# EasyEDA Pro project Lumino Uno PCB.epro

# Schematic Schematic1
Board Name: Board1; Create Date: 2026-05-08; Page Name: P1; Project Name: PCBmcu; Schematic Name: Schematic1; Update Date: 2026-05-17; Company: EasyEDA.com; Page Size: A4; Version: V1.0
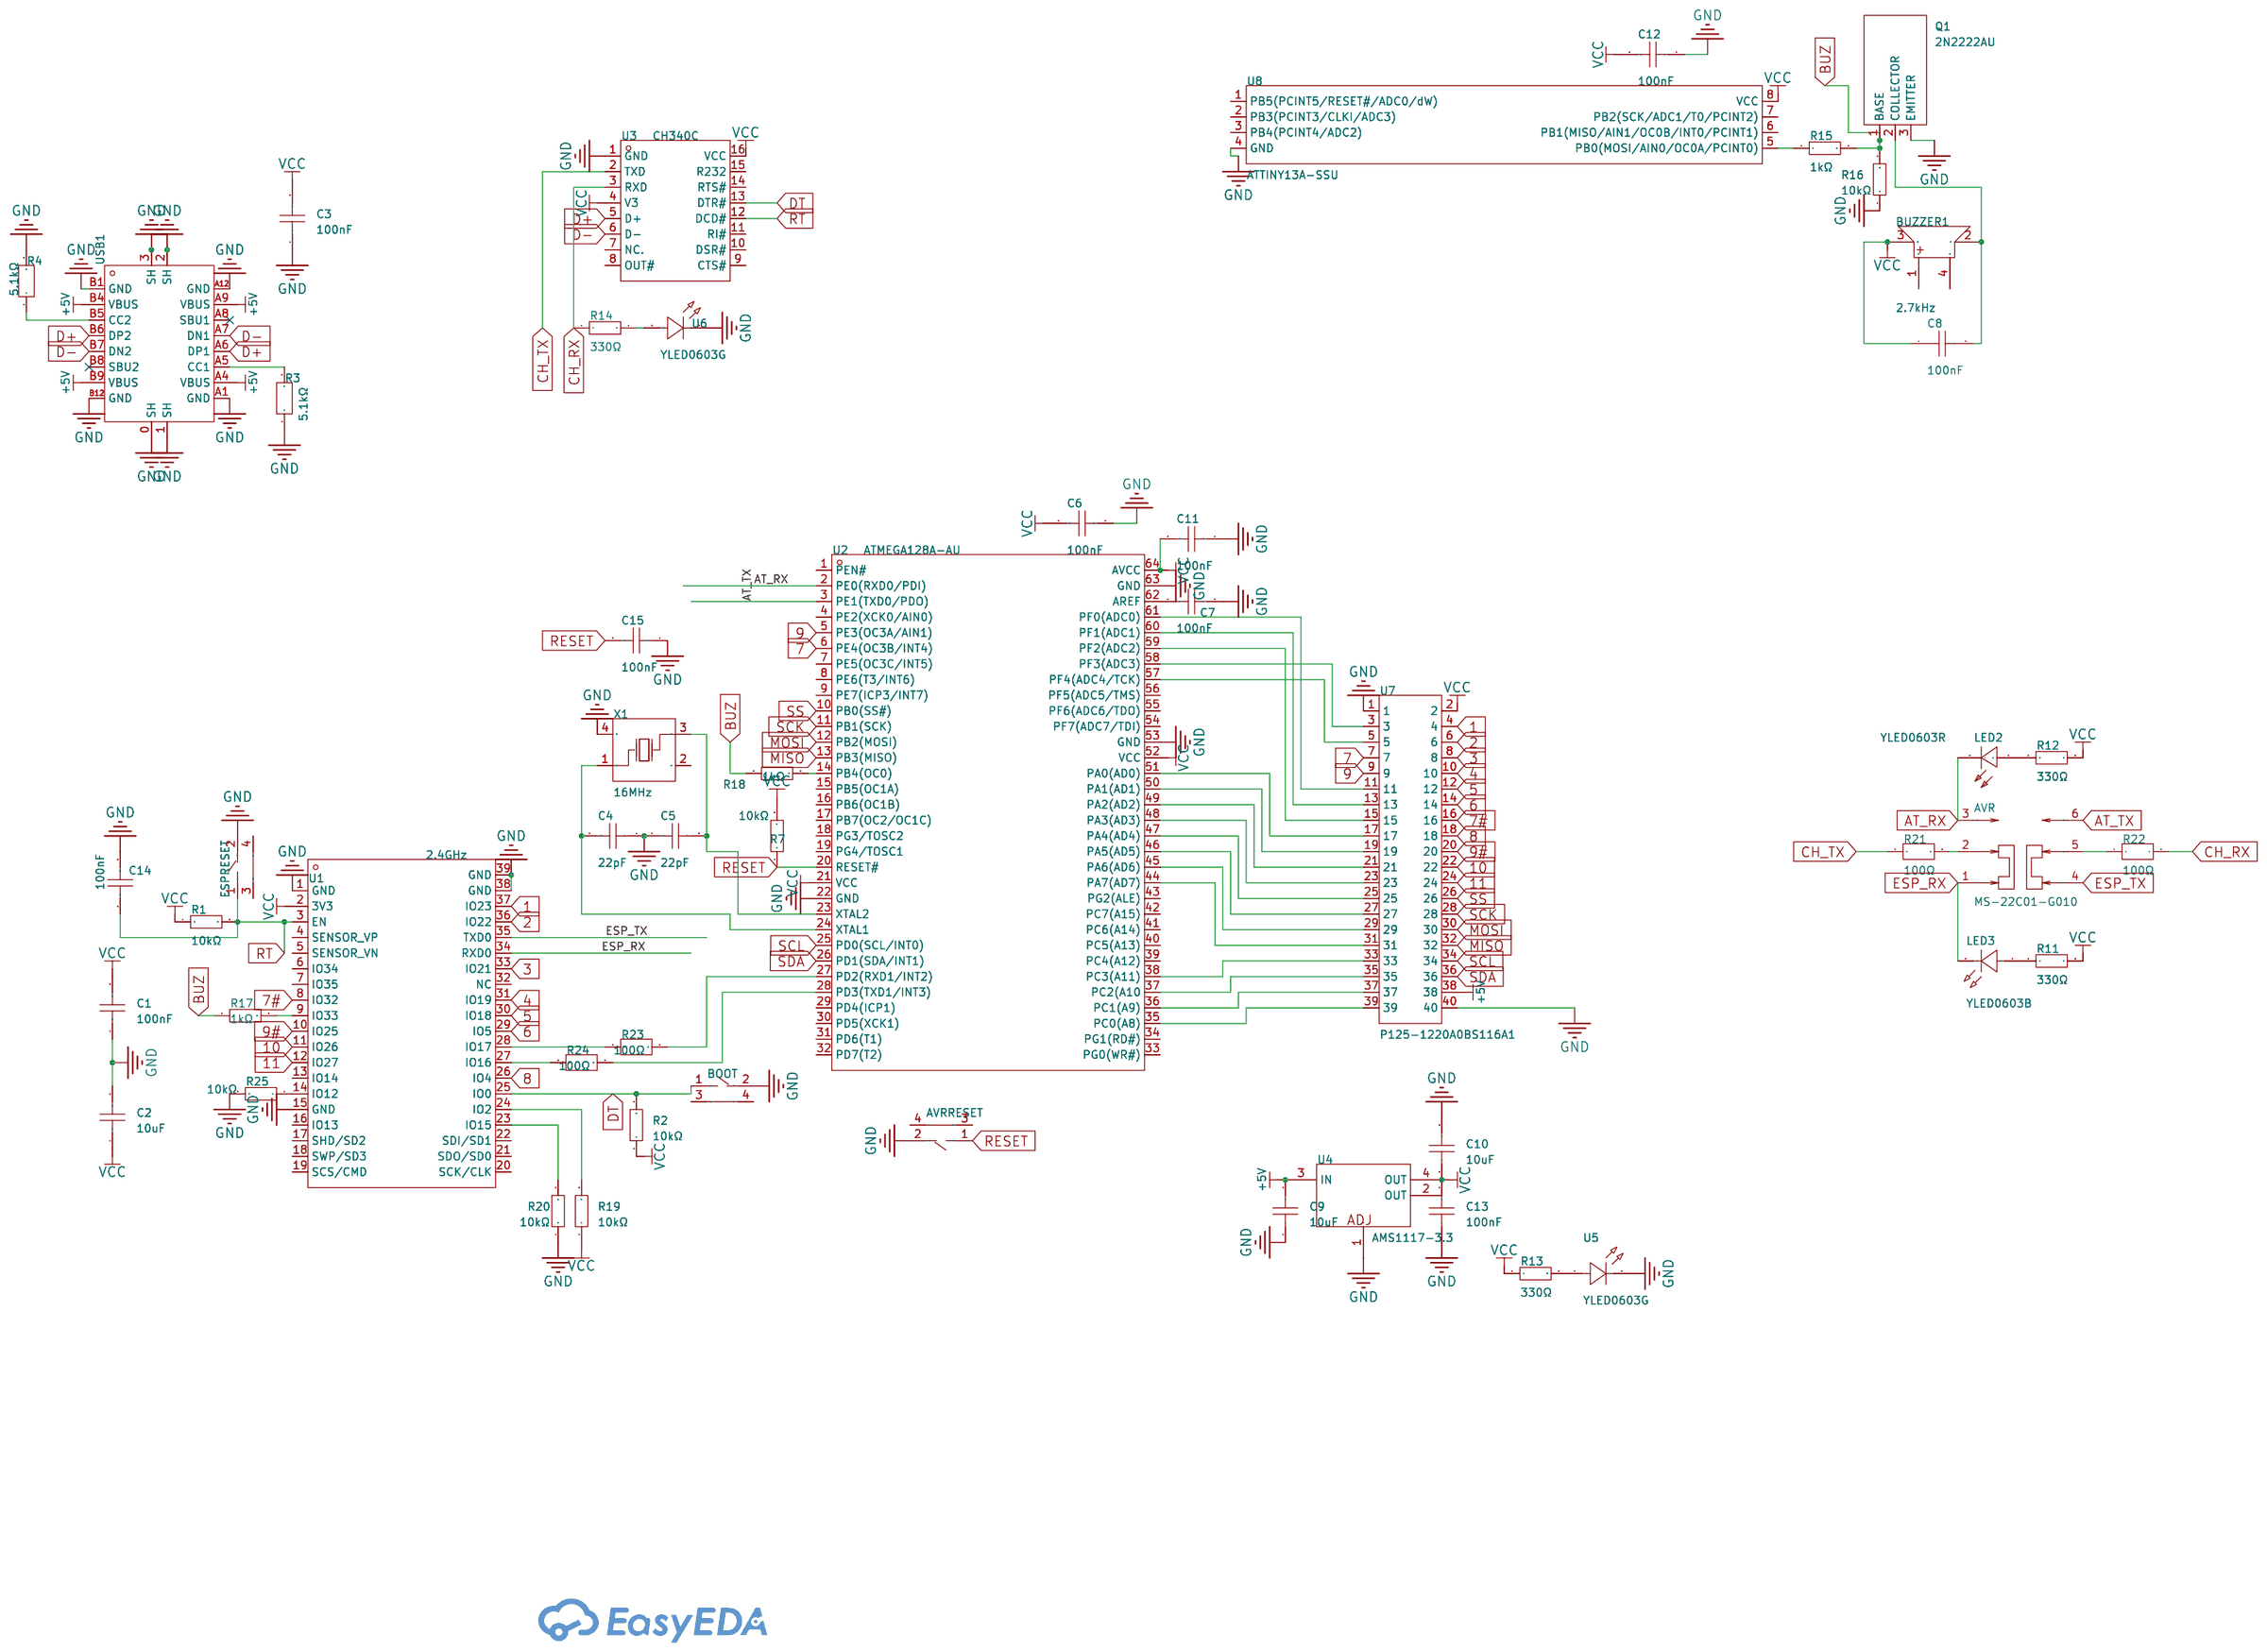
[diagram p0: schematic sheet]

## Parts
AVR  MS-22C01-G010  [SW-SMD_6P-L7.2-W3.5-P2.50-LS6.0-TL]
AVRRESET  TC-S3601-3.5-260G-F0.6  [SW-SMD_TC-S3601-3.5-260G-F0.6]
BOOT  TC-S3601-3.5-260G-F0.6  [SW-SMD_TC-S3601-3.5-260G-F0.6]
BUZZER1  2.7kHz  [BUZ-SMD_4P-L8.5-W8.5-BR-1]
C1  100nF  [C0603]
C2  10uF  [C0603]
C3  100nF  [C0603]
C4  22pF  [C0805]
C5  22pF  [C0805]
C6  100nF  [C0603]
C7  100nF  [C0603]
C8  100nF  [C0603]
C9  10uF  [C0603]
C10  10uF  [C0603]
C11  100nF  [C0603]
C12  100nF  [C0603]
C13  100nF  [C0603]
C14  100nF  [C0603]
C15  100nF  [C0603]
ESPRESET  TC-S3601-3.5-260G-F0.6  [SW-SMD_TC-S3601-3.5-260G-F0.6]
LED2  YLED0603R  [LED0603-FD]
LED3  YLED0603B  [LED0603-FD]
Q1  2N2222AU  [SOT-89-3_L4.5-W2.4-P1.50-LS4.0-BR]
R1  10kΩ  [R0603_NEW]
R2  10kΩ  [R0603_NEW]
R3  5.1kΩ  [R0603_NEW]
R4  5.1kΩ  [R0603_NEW]
R7  10kΩ  [R0603_NEW]
R11  330Ω  [R0603_NEW]
R12  330Ω  [R0603_NEW]
R13  330Ω  [R0603_NEW]
R14  330Ω  [R0603_NEW]
R15  1kΩ  [R0603_NEW]
R16  10kΩ  [R0603_NEW]
R17  1kΩ  [R0603_NEW]
R18  1kΩ  [R0603_NEW]
R19  10kΩ  [R0603_NEW]
R20  10kΩ  [R0603_NEW]
R21  100Ω  [R0603_NEW]
R22  100Ω  [R0603_NEW]
R23  100Ω  [R0603_NEW]
R24  100Ω  [R0603_NEW]
R25  10kΩ  [R0603_NEW]
U1  2.4GHz  [WIFIM-SMD_ESP32-WROOM-32-N4]
U2  ATMEGA128A-AU  [LQFP-64_L14.0-W14.0-P0.80-LS16.0-BL]
U3  CH340C  [SOP-16_L10.0-W3.9-P1.27-LS6.0-BL]
U4  AMS1117-3.3  [SOT-223_L6.5-W3.5-P2.30-LS7.0-BR]
U5  YLED0603G  [LED0603-FD]
U6  YLED0603G  [LED0603-FD]
U7  P125-1220A0BS116A1  [HDR-TH_40P-P2.54-V-M-R2-C20-S2.54_10-97-7406]
U8  ATTINY13A-SSU  [SOIC-8_L4.9-W3.9-P1.27-LS6.0-BL]
USB1  USB-TYPE-C-018  [USB-C_SMD-TYPE-C-31-M-12]
X1  16MHz  [OSC-SMD_4P-L7.0-W5.0-BL]

## Library data of the parts
AVR = MS-22C01-G010: Circuit:DPDT Actuator Style:Rectangular Columnar Termination Style:Gull Wing Length:7mm Width:3.5mm Switch Height:2.5mm Mounting Type:Surface Mount,Vertical Actuator Color:Black Current Rating:50mA Voltage Rating:12V Life:10,000 Cycles Operating Temperatu; LCSC Part Name: 微型拨动开关 G1.0mm; Supplier Part: C2837066; Manufacturer: G-Switch(品赞); Supplier Footprint: SMD,7x3.5mm; JLCPCB Part Class: Extended Part; Datasheet: https://item.szlcsc.com/datasheet/MS-22C01-G010/3006434.html; Supplier: LCSC; Circuit: DPDT; Actuator Style: Rectangular Columnar; Termination Style: Gull Wing; Length: 7mm; Width: 3.5mm; Switch Height: 2.5mm; Mounting Type: Surface Mount,Vertical; Actuator Color: Black; Current Rating: 50mA; Voltage Rating: 12V; Life: 10,000 Cycles; Operating Temperature: -40℃~+85℃
AVRRESET BOOT ESPRESET = TC-S3601-3.5-260G-F0.6: Circuit:SPST Actuator Style:Rectangular Button Operating Force:2.6N Mounting Type:Surface Mount, Right Angle Length:3.5mm Width:7mm with Bracket:With Bracket Contact Current:50mA Voltage Rating:12V With Lamp:No Termination Style:SMD(SMT) Tab Life:30,000 c; LCSC Part Name: 3.5mm 7mm 12V 50mA; Supplier Part: C49101620; Manufacturer: HCTL(华灿天禄); Supplier Footprint: SMD; JLCPCB Part Class: Extended Part; Datasheet: https://item.szlcsc.com/datasheet/TC-S3601-3.5-260G-F0.6/51479429.html; Supplier: LCSC; Circuit: SPST; Actuator Style: Rectangular Button; Operating Force: 2.6N; Mounting Type: Surface Mount, Right Angle; Length: 3.5mm; Width: 7mm; with Bracket: With Bracket; Contact Current: 50mA; Voltage Rating: 12V; With Lamp: No; Termination Style: SMD(SMT) Tab; Life: 30,000 cycles
BUZZER1 = SMD-8503-3627-16Ω: Driver Circuitry:Passive (Externally Driven) Technology:Electromagnetic Voltage - Supply:3.6V Voltage - Supply:3.6V Frequency:2.7kHz Sound Pressure Level(SPL):80dB Length:8.5mm Width:8.5mm Height:3mm; LCSC Part Name: 贴片无源蜂鸣器; Supplier Part: C2685545; Manufacturer: S&S(海旭); Supplier Footprint: SMD,8.5x8.5mm; JLCPCB Part Class: Extended Part; Datasheet: https://item.szlcsc.com/datasheet/SMD-8503-3627-16%25CE%25A9/2785331.html; Supplier: LCSC; Driver Circuitry: Passive (Externally Driven); Technology: Electromagnetic; Voltage - Supply: 3.6V; Sound Pressure Level(SPL): 80dB; Length: 8.5mm; Width: 8.5mm; Height: 3mm
C1 C3 C6-C8 C11-C15 = CC0603KRX7R9BB104: Capacitance:100nF Tolerance:±10% Tolerance:±10% Voltage Rating:50V Temperature Coefficient:X7R; LCSC Part Name: 100nF ±10% 50V; Supplier Part: C14663; Manufacturer: YAGEO(国巨); Supplier Footprint: 0603; JLCPCB Part Class: Basic Part; Datasheet: https://item.szlcsc.com/datasheet/CC0603KRX7R9BB104/15331.html; Supplier: LCSC; Tolerance: ±10%; Voltage Rating: 50V; Temperature Coefficient: X7R
C2 C9 C10 = CL10A106KP8NNNC: Capacitance:10uF Tolerance:±10% Tolerance:±10% Voltage Rating:10V Temperature Coefficient:X5R; LCSC Part Name: 10uF ±10% 10V; Supplier Part: C19702; Manufacturer: SAMSUNG(三星); Supplier Footprint: 0603; JLCPCB Part Class: Basic Part; Datasheet: https://item.szlcsc.com/datasheet/CL10A106KP8NNNC/20411.html; Supplier: LCSC; Tolerance: ±10%; Voltage Rating: 10V; Temperature Coefficient: X5R
C4 C5 = TCC0805COG220J500BT: Capacitance:22pF Tolerance:±5% Tolerance:±5% Voltage Rating:50V Temperature Coefficient:C0G; LCSC Part Name: 22pF ±5% 50V; Supplier Part: C376875; Manufacturer: CCTC(三环); Supplier Footprint: 0805; JLCPCB Part Class: Extended Part; Datasheet: https://item.szlcsc.com/datasheet/TCC0805COG220J500BT/349234.html; Supplier: LCSC; Tolerance: ±5%; Voltage Rating: 50V; Temperature Coefficient: C0G
LED2 = YLED0603R: Lamp Holder Type:-；- Illumination Color:Red Voltage - Forward(Vf):1.8V~2.4V Voltage - Forward(Vf):1.8V~2.4V Power(Watts):- Forward Current:25mA Wavelength - Dominant:620nm~625nm Wavelength - Dominant:620nm~625nm Peak Wavelength:- Diode Configuration:Discr; LCSC Part Name: 红色 独立二极管; Supplier Part: C19171390; Manufacturer: YONGYUTAI(永裕泰); Supplier Footprint: 0603; JLCPCB Part Class: Extended Part; Datasheet: https://item.szlcsc.com/datasheet/YLED0603R/20382441.html; Supplier: LCSC; Lamp Holder Type: -；-; Illumination Color: Red; Voltage - Forward(Vf): 1.8V~2.4V; Forward Current: 25mA; Wavelength - Dominant: 620nm~625nm; Diode Configuration: Discrete Diode; Luminous Intensity: 120mcd; Viewing Angle: 120°; Operating Temperature: -40℃~+85℃
LED3 = YLED0603B: Lamp Holder Type:- Illumination Color:Blue Voltage - Forward(Vf):2.6V~3.2V Voltage - Forward(Vf):2.6V~3.2V Power(Watts):- Forward Current:30mA Wavelength - Dominant:460nm~475nm Wavelength - Dominant:460nm~475nm Peak Wavelength:- Diode Configuration:Discre; LCSC Part Name: 蓝色 独立二极管; Supplier Part: C19171394; Manufacturer: YONGYUTAI(永裕泰); Supplier Footprint: 0603; JLCPCB Part Class: Extended Part; Datasheet: https://item.szlcsc.com/datasheet/YLED0603B/20382445.html; Supplier: LCSC; Illumination Color: Blue; Voltage - Forward(Vf): 2.6V~3.2V; Forward Current: 30mA; Wavelength - Dominant: 460nm~475nm; Diode Configuration: Discrete Diode; Luminous Intensity: 42mcd~86mcd; Viewing Angle: 120°; Operating Temperature: -40℃~+85℃
Q1 = 2N2222AU: type:NPN Current - Collector(Ic):600mA Collector - Emitter Voltage VCEO:40V Pd - Power Dissipation:500mW DC Current Gain:300@150mA,10V DC Current Gain:300@150mA,10V Transition frequency(fT):300MHz Current - Collector Cutoff:10nA Vce Saturation(VCE(sat)):1; LCSC Part Name: NPN 电流:600mA 电压:40V; Supplier Part: C21714170; Manufacturer: CBI(创基); Supplier Footprint: SOT-89; JLCPCB Part Class: Extended Part; Datasheet: https://item.szlcsc.com/datasheet/2N2222AU/23141081.html; Supplier: LCSC; type: NPN; Current - Collector(Ic): 600mA; Collector - Emitter Voltage VCEO: 40V; Pd - Power Dissipation: 500mW; DC Current Gain: 300@150mA,10V; Transition frequency(fT): 300MHz; Current - Collector Cutoff: 10nA; Vce Saturation(VCE(sat)): 1V@500mA,50mA; Operating Temperature: -55℃~+150℃; Emitter-Base Voltage(Vebo): 6V; Number: 1 NPN
R1 R2 R7 R16 R19 R20 R25 = RC0603FR-0710KL: Type:Thick Film Resistors Resistance: Tolerance:±1% Tolerance:±1% Power(Watts): Overload Voltage (Max): Temperature Coefficient:±100ppm/℃ Temperature Coefficient:±100ppm/℃ Operating Temperature Range:-55℃~+155℃ Operating Temperature Range:-55℃~+155℃; LCSC Part Name: 厚膜电阻 10kΩ ±1% 100mW; Supplier Part: C98220; Manufacturer: YAGEO(国巨); Supplier Footprint: 0603; JLCPCB Part Class: Extended Part; Datasheet: https://atta.szlcsc.com/upload/public/pdf/source/20180927/C295883_E8D83085EA81BD7DE0B2B681138C15EE.pdf; Supplier: LCSC; Type: Thick Film Resistors; Tolerance: ±1%; Temperature Coefficient: ±100ppm/℃; Operating Temperature Range: -55℃~+155℃
R3 R4 = FRC0603F5101TS: Type:Thick Film Resistor Resistance:5.1kΩ Tolerance:±1% Tolerance:±1% Power(Watts):100mW Voltage-Supply(Max):75V Temperature Coefficient:±100ppm/℃ Temperature Coefficient:±100ppm/℃ Operating Temperature:-55℃~+155℃ Operating Temperature:-55℃~+155℃; LCSC Part Name: 5.1kΩ ±1% 100mW 厚膜电阻; Supplier Part: C2907044; Manufacturer: FOJAN(富捷); Supplier Footprint: 0603; JLCPCB Part Class: Extended Part; Supplier: LCSC; Type: Thick Film Resistor; Tolerance: ±1%; Power(Watts): 100mW; Voltage-Supply(Max): 75V; Temperature Coefficient: ±100ppm/℃; Operating Temperature: -55℃~+155℃
R11-R14 = RC0603FR-07330RL: Type:Thick Film Resistors Resistance: Tolerance:±1% Tolerance:±1% Power(Watts): Overload Voltage (Max): Temperature Coefficient:±100ppm/℃ Temperature Coefficient:±100ppm/℃ Operating Temperature Range:-55℃~+155℃ Operating Temperature Range:-55℃~+155℃; LCSC Part Name: 厚膜电阻 330Ω ±1% 100mW; Supplier Part: C105881; Manufacturer: YAGEO(国巨); Supplier Footprint: 0603; JLCPCB Part Class: Extended Part; Datasheet: https://atta.szlcsc.com/upload/public/pdf/source/20180821/C275644_0D56F95EFF785E7D9A1FEF436B37DA78.pdf; Supplier: LCSC; Type: Thick Film Resistors; Tolerance: ±1%; Temperature Coefficient: ±100ppm/℃; Operating Temperature Range: -55℃~+155℃
R15 R17 R18 = RC0603FR-071KL: Type:Thick Film Resistor Resistance:1kΩ Tolerance:±1% Tolerance:±1% Power(Watts):100mW Voltage-Supply(Max):75V Temperature Coefficient:±100ppm/℃ Temperature Coefficient:±100ppm/℃ Operating Temperature:-55℃~+155℃ Operating Temperature:-55℃~+155℃; LCSC Part Name: 厚膜电阻 1kΩ ±1% 100mW; Supplier Part: C22548; Manufacturer: YAGEO(国巨); Supplier Footprint: 0603; JLCPCB Part Class: Extended Part; Datasheet: https://item.szlcsc.com/datasheet/RC0603FR-071KL/23274.html; Supplier: LCSC; Type: Thick Film Resistor; Tolerance: ±1%; Power(Watts): 100mW; Voltage-Supply(Max): 75V; Temperature Coefficient: ±100ppm/℃; Operating Temperature: -55℃~+155℃
R21-R24 = 0603 ±1% 100Ω: Type:Thick Film Resistor Resistance:100Ω Tolerance:±1% Tolerance:±1% Power(Watts):100mW Voltage-Supply(Max):75V Temperature Coefficient:±100ppm/℃ Temperature Coefficient:±100ppm/℃ Operating Temperature:-55℃~+155℃ Operating Temperature:-55℃~+155℃; LCSC Part Name: 厚膜电阻 100Ω ±1% 100mW; Supplier Part: C2889384; Manufacturer: VO(翔胜); Supplier Footprint: 0603; Datasheet: https://item.szlcsc.com/datasheet/0603%2520%25C2%25B11%2525%2520100%25CE%25A9/3112135.html; Supplier: LCSC; Type: Thick Film Resistor; Tolerance: ±1%; Power(Watts): 100mW; Voltage-Supply(Max): 75V; Temperature Coefficient: ±100ppm/℃; Operating Temperature: -55℃~+155℃
U1 = ESP32-WROOM-32-N4: Utilized IC / Part:ESP32-DOWDQ6 Wireless Standard:Bluetooth4.2 Interface Type:I2C；GPIO；UART；DAC；SPI；PWM；SDIO；ADC Frequency:2.4GHz Output Power:20dBm Output Power:20dBm Voltage - Supply:2.7V~3.6V Voltage - Supply:2.7V~3.6V Sensitivity:-98dBm Sensitivity:-9; LCSC Part Name: 不带固件 WiFi+蓝牙4.2+双核CPU模块; Supplier Part: C82899; Manufacturer: ESPRESSIF(乐鑫); Supplier Footprint: SMD,25.5x18mm; Datasheet: https://item.szlcsc.com/datasheet/ESP32-WROOM-32-N4/84060.html; Supplier: LCSC; Utilized IC / Part: ESP32-DOWDQ6; Wireless Standard: Bluetooth4.2; Interface Type: I2C；GPIO；UART；DAC；SPI；PWM；SDIO；ADC; Output Power: 20dBm; Voltage - Supply: 2.7V~3.6V; Sensitivity: -98dBm; Operating Temperature: -40℃~+85℃
U2 = ATMEGA128A-AU: CPU Core:AVR CPU Maximum Speed:16MHz Program Storage Size:128KB Program Memory Type:FLASH EEPROM:4KB Number of I/O:53 ADC (Bit):10bit Voltage - Supply:2.7V~5.5V Voltage - Supply:2.7V~5.5V Applications:-; LCSC Part Name: 8位AVR微控制器，带有128K字节系统内可编程闪存; Supplier Part: C6510; Manufacturer: MICROCHIP(美国微芯); Supplier Footprint: TQFP-64(14x14); JLCPCB Part Class: Extended Part; Datasheet: https://item.szlcsc.com/datasheet/ATMEGA128A-AU/6975.html; Supplier: LCSC; CPU Core: AVR; CPU Maximum Speed: 16MHz; Program Storage Size: 128KB; Program Memory Type: FLASH; EEPROM: 4KB; Number of I/O: 53; ADC (Bit): 10bit; Voltage - Supply: 2.7V~5.5V
U3 = CH340C: Applications Function:Transceiver USB Protocol:USB 2.0 Voltage - Supply:3.3V；5V Voltage - Supply:3.3V；5V Data Rate:2Mbps Operating Temperature:-20℃~+70℃ Operating Temperature:-20℃~+70℃ Current - Supply:7mA Supply Current (Iq):50uA; LCSC Part Name: USB转串口芯片; Supplier Part: C84681; Manufacturer: WCH(南京沁恒); Supplier Footprint: SOP-16; JLCPCB Part Class: Extended Part; Datasheet: https://item.szlcsc.com/datasheet/CH340C/85852.html; Supplier: LCSC; Applications Function: Transceiver; USB Protocol: USB 2.0; Voltage - Supply: 3.3V；5V; Data Rate: 2Mbps; Operating Temperature: -20℃~+70℃; Current - Supply: 7mA; Supply Current (Iq): 50uA
U4 = AMS1117-3.3_C22458961: Output Type:Fixed Voltage - Supply:20V Output Voltage:3.3V Output Voltage:3.3V Output Current:1A Power Supply Rejection Ratio (PSRR):50dB@(120Hz) Voltage Dropout:1.15V@(1A) standby current:5mA Features:Over Temperature Protection；Over Current Protection O; LCSC Part Name: 丝印AMS11173.31407 3.3V 1A 20V; Supplier Part: C22458961; Manufacturer: ALJ(龙晶微); Supplier Footprint: SOT-223; JLCPCB Part Class: Extended Part; Datasheet: https://item.szlcsc.com/datasheet/AMS1117-3.3/24132009.html; Supplier: LCSC; Output Type: Fixed; Voltage - Supply: 20V; Output Voltage: 3.3V; Output Current: 1A; Power Supply Rejection Ratio (PSRR): 50dB@(120Hz); Voltage Dropout: 1.15V@(1A); standby current: 5mA; Features: Over Temperature Protection；Over Current Protection; Operating Temperature: -40℃~+125℃@(Tj)
U5 U6 = YLED0603G: Lamp Holder Type:- Illumination Color:Emerald Green Voltage - Forward(Vf):2.6V~3.2V Voltage - Forward(Vf):2.6V~3.2V Power(Watts):- Forward Current:25mA Wavelength - Dominant:510nm~531nm Wavelength - Dominant:510nm~531nm Peak Wavelength:- Peak Wavelength:-; LCSC Part Name: 翠绿色 独立二极管; Supplier Part: C19273151; Manufacturer: YONGYUTAI(永裕泰); Supplier Footprint: 0603; JLCPCB Part Class: Extended Part; Datasheet: https://item.szlcsc.com/datasheet/YLED0603G/20555405.html; Supplier: LCSC; Illumination Color: Emerald Green; Voltage - Forward(Vf): 2.6V~3.2V; Forward Current: 25mA; Wavelength - Dominant: 510nm~531nm; Diode Configuration: Discrete Diode; Luminous Intensity: 358mcd; Viewing Angle: 120°; Operating Temperature: -40℃~+85℃
U7 = P125-1220A0BS116A1: Pin Structure:2x20P Pitch:2.54mm Row Spacing:2.54mm Circluar Pins/Square Pins:Policy Mounting Type:Straight Number of Rows:Double Row Number of Pins:40P Length of Mating Pin:6mm Insulation Height:2.5mm Length of End Connection Pin:3mm Contact Material:Bra; LCSC Part Name: 2x20P 间距:2.54mm 方针 直插; Supplier Part: C19190512; Manufacturer: Yxcon(宇熙精密); Supplier Footprint: 插件,P=2.54mm; JLCPCB Part Class: Extended Part; Datasheet: https://atta.szlcsc.com/upload/public/pdf/source/20231110/933F8D648B10E9101EFC894132A28518.pdf; Supplier: LCSC; Pin Structure: 2x20P; Pitch: 2.54mm; Row Spacing: 2.54mm; Circluar Pins/Square Pins: Policy; Mounting Type: Straight; Number of Rows: Double Row; Number of Pins: 40P; Length of Mating Pin: 6mm; Insulation Height: 2.5mm; Length of End Connection Pin: 3mm; Contact Material: Brass; Contact Plating: Gold; Operating Temperature: -40℃~+105℃; Color: Black
U8 = ATTINY13A-SSU: CPU Core:AVR CPU Maximum Speed:20MHz Program Storage Size:1KB Number of I/O:6 ADC (Bit):10bit Voltage - Supply:1.8V~5.5V Voltage - Supply:1.8V~5.5V Applications:-; Supplier Part: C14075; Manufacturer: MICROCHIP(美国微芯); Supplier Footprint: SOIC-8; JLCPCB Part Class: Extended Part; Datasheet: https://item.szlcsc.com/datasheet/ATTINY13A-SSU/14732.html; Supplier: LCSC; CPU Core: AVR; CPU Maximum Speed: 20MHz; Program Storage Size: 1KB; Number of I/O: 6; ADC (Bit): 10bit; Voltage - Supply: 1.8V~5.5V
USB1 = USB-TYPE-C-018: Connector Type:Type-C Protocol Standard:- Gender:Female Mounting Type:Surface Mount, Right Angle Number of Contacts:16P Number of Ports:1 Current Rating-Power:3A Voltage Rating:5V Connect-Disconnect Life:10,000 cycles Length:7.35mm Operating Temperature:-; LCSC Part Name: Type-C 母 卧贴; Supplier Part: C2927038; Manufacturer: DEALON(德艺隆); Supplier Footprint: SMD; JLCPCB Part Class: Extended Part; Datasheet: https://item.szlcsc.com/datasheet/USB-TYPE-C-018/3252507.html; Supplier: LCSC; Connector Type: Type-C; Gender: Female; Mounting Type: Surface Mount, Right Angle; Number of Contacts: 16P; Number of Ports: 1; Current Rating-Power: 3A; Voltage Rating: 5V; Connect-Disconnect Life: 10,000 cycles; Length: 7.35mm; Operating Temperature: -25℃~+85℃
X1 = OCETDLJANF-16MHZ: Frequency:16MHz Voltage - Supply:3.3V Voltage - Supply:3.3V Current - Supply:10mA Frequency Stability:±25ppm Frequency Stability:±25ppm Operating Temperature:-40℃~+85℃ Operating Temperature:-40℃~+85℃; LCSC Part Name: 16MHz 3.3V; Supplier Part: C295103; Manufacturer: TAITIEN(泰艺电子); Supplier Footprint: SMD7050-4P; JLCPCB Part Class: Extended Part; Datasheet: https://item.szlcsc.com/datasheet/OCETDLJANF-16MHZ/279933.html; Supplier: LCSC; Voltage - Supply: 3.3V; Current - Supply: 10mA; Frequency Stability: ±25ppm; Operating Temperature: -40℃~+85℃

## Nets
+5V: C9.2 U4.3(IN) U7.38 USB1.A4(VBUS) USB1.A9(VBUS) USB1.B4(VBUS) USB1.B9(VBUS)
GND: AVRRESET.2 BOOT.2 C1.1 C2.2 C3.1 C4.1 C5.1 C6.1 C7.1 C9.1 C10.2 C11.1 C12.1 C13.1 C14.2 C15.1 ESPRESET.2 Q1.3(EMITTER) R3.1 R4.2 R16.1 R20.1 R25.2 U1.1(GND) U1.15(GND) U1.38(GND) U1.39(GND) U2.22(GND) U2.53(GND) U2.63(GND) U3.1(GND) U4.1(ADJ) U5.2(-) U6.2(-) U7.1 U7.40 U8.4(GND) USB1.0(SH) USB1.1(SH) USB1.2(SH) USB1.3(SH) USB1.A1(GND) USB1.A12(GND) USB1.B1(GND) USB1.B12(GND) X1.4(vdd)
VCC: BUZZER1.3 C1.2 C2.1 C3.2 C6.2 C8.1 C10.1 C11.2 C12.2 C13.2 R1.1 R2.1 R7.2 R11.2 R12.2 R13.1 R19.1 U1.2(3V3) U2.21(VCC) U2.52(VCC) U2.64(AVCC) U3.4(V3) U3.16(VCC) U4.4(OUT) U7.2 U8.8(VCC)
1: U1.37(IO23) U7.4
2: U1.36(IO22) U7.6
3: U1.33(IO21) U7.8
4: U1.31(IO19) U7.10
5: U1.30(IO18) U7.12
6: U1.29(IO5) U7.14
7: U2.6(PE4(OC3B/INT4)) U7.7
7#: U1.8(IO32) U7.16
8: U1.26(IO4) U7.18
9: U2.5(PE3(OC3A/AIN1)) U7.9
9#: U1.10(IO25) U7.20
10: U1.11(IO26) U7.22
11: U1.12(IO27) U7.24
AT_RX: AVR.3 LED2.2(-) U2.2(PE0(RXD0/PDI))
AT_TX: AVR.6 U2.3(PE1(TXD0/PDO))
BUZ: Q1.1(BASE) R15.2 R16.2 R17.1 R18.1
CH_RX: R14.1 R22.2 U3.3(RXD)
CH_TX: R21.1 U3.2(TXD)
D+: U3.5(D+) USB1.A6(DP1) USB1.B6(DP2)
D-: U3.6(D-) USB1.A7(DN1) USB1.B7(DN2)
DT: BOOT.1 R2.2 U1.25(IO0) U3.13(DTR#)
ESP_RX: AVR.1 LED3.2(K) U1.34(RXD0)
ESP_TX: AVR.4 U1.35(TXD0)
MISO: U2.13(PB3(MISO)) U7.32
MOSI: U2.12(PB2(MOSI)) U7.30
RESET: AVRRESET.1 C15.2 R7.1 U2.20(RESET#)
RT: C14.1 ESPRESET.1 R1.2 U1.3(EN) U3.12(DCD#)
SCK: U2.11(PB1(SCK)) U7.28
SCL: U2.25(PD0(SCL/INT0)) U7.34
SDA: U2.26(PD1(SDA/INT1)) U7.36
SS: U2.10(PB0(SS#)) U7.26
$1N2843: R3.2 USB1.A5(CC1)
$1N2847: R4.1 USB1.B5(CC2)
$1N4033: R14.2 U6.1(+)
$1N4987: C5.2 U2.23(XTAL2) X1.3(out)
$1N5002: C4.2 U2.24(XTAL1) X1.1(tri)
$1N5344: C7.2 U2.62(AREF)
$1N8862: U2.35(PC0(A8)) U7.39
$1N8867: U2.36(PC1(A9)) U7.37
$1N8877: U2.37(PC2(A10) U7.35
$1N8884: U2.38(PC3(A11)) U7.33
$1N9216: U2.44(PA7(AD7)) U7.31
$1N9221: U2.45(PA6(AD6)) U7.29
$1N9253: U2.46(PA5(AD5)) U7.27
$1N9297: U2.47(PA4(AD4)) U7.25
$1N9314: U2.48(PA3(AD3)) U7.23
$1N9319: U2.49(PA2(AD2)) U7.21
$1N9331: U2.50(PA1(AD1)) U7.19
$1N9344: U2.59(PF2(ADC2)) U7.15
$1N9350: U2.60(PF1(ADC1)) U7.13
$1N9358: U2.61(PF0(ADC0)) U7.11
$1N9422: U2.51(PA0(AD0)) U7.17
$1N9481: U2.58(PF3(ADC3)) U7.3
$1N9486: U2.57(PF4(ADC4/TCK)) U7.5
$1N13451: LED2.1(+) R12.1
$1N13493: R13.2 U5.1(+)
$1N13579: LED3.1(A) R11.1
$1N15542: R15.1 U8.5(PB0(MOSI/AIN0/OC0A/PCINT0))
$1N15554: BUZZER1.2 C8.2 Q1.2(COLLECTOR)
$1N17580: R17.2 U1.9(IO33)
$1N17638: R18.2 U2.14(PB4(OC0))
$1N19795: R19.2 U1.24(IO2)
$1N19800: R20.2 U1.23(IO15)
$1N20128: AVR.2 R21.2
$1N20208: AVR.5 R22.1
$1N20285: R23.1 U1.28(IO17)
$1N20290: R23.2 U2.27(PD2(RXD1/INT2))
$1N20374: R25.1 U1.14(IO12)
Net-(R24-1): R24.1 U1.27(IO16)
Net-(R24-2): R24.2 U2.28(PD3(TXD1/INT3))

Not connected (* = marked no-connect by the designer): AVRRESET 3 4; BOOT 3 4; BUZZER1 1 4; ESPRESET 3 4; U1 4(SENSOR_VP) 5(SENSOR_VN) 6(IO34) 7(IO35) 13(IO14) 16(IO13) 17(SHD/SD2) 18(SWP/SD3) 19(SCS/CMD) 20(SCK/CLK) 21(SDO/SD0) 22(SDI/SD1) 32(NC); U2 1(PEN#) 4(PE2(XCK0/AIN0)) 7(PE5(OC3C/INT5)) 8(PE6(T3/INT6)) 9(PE7(ICP3/INT7)) 15(PB5(OC1A)) 16(PB6(OC1B)) 17(PB7(OC2/OC1C)) 18(PG3/TOSC2) 19(PG4/TOSC1) 29(PD4(ICP1)) 30(PD5(XCK1)) 31(PD6(T1)) 32(PD7(T2)) 33(PG0(WR#)) 34(PG1(RD#)) 39(PC4(A12)) 40(PC5(A13)) 41(PC6(A14)) 42(PC7(A15)) 43(PG2(ALE)) 54(PF7(ADC7/TDI)) 55(PF6(ADC6/TDO)) 56(PF5(ADC5/TMS)); U3 7(NC.) 8(OUT#) 9(CTS#) 10(DSR#) 11(RI#) 14(RTS#) 15(R232); U4 2(OUT); U8 1(PB5(PCINT5/RESET#/ADC0/dW)) 2(PB3(PCINT3/CLKI/ADC3)) 3(PB4(PCINT4/ADC2)) 6(PB1(MISO/AIN1/OC0B/INT0/PCINT1)) 7(PB2(SCK/ADC1/T0/PCINT2)); USB1 A8(SBU1)* B8(SBU2)*; X1 2(GND)

# Board PCB1
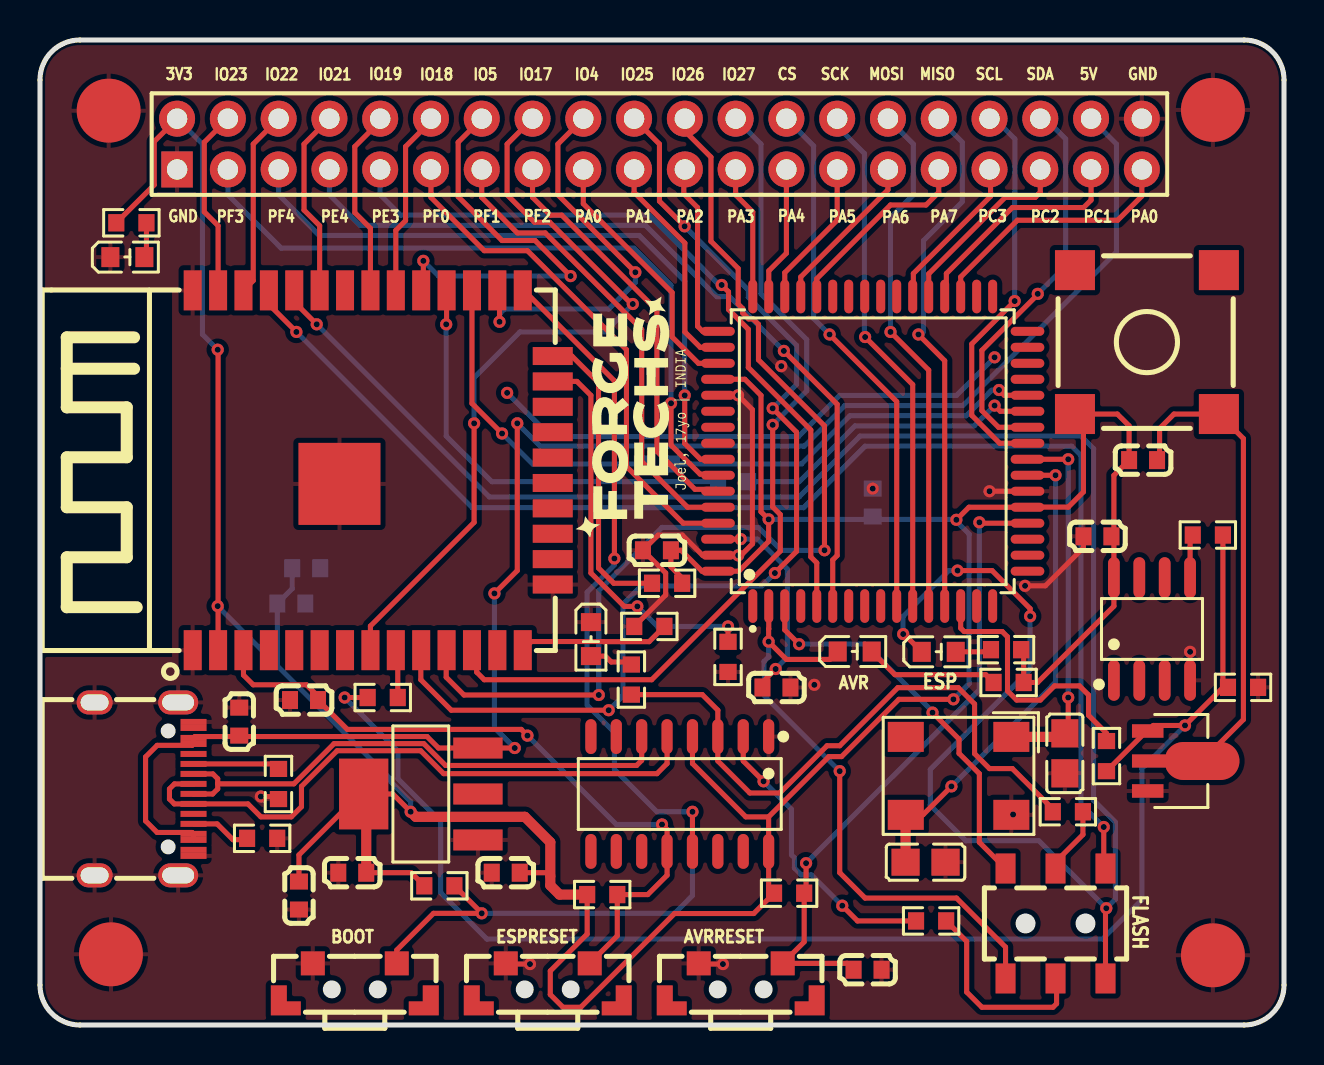
[diagram p1: board, top side]
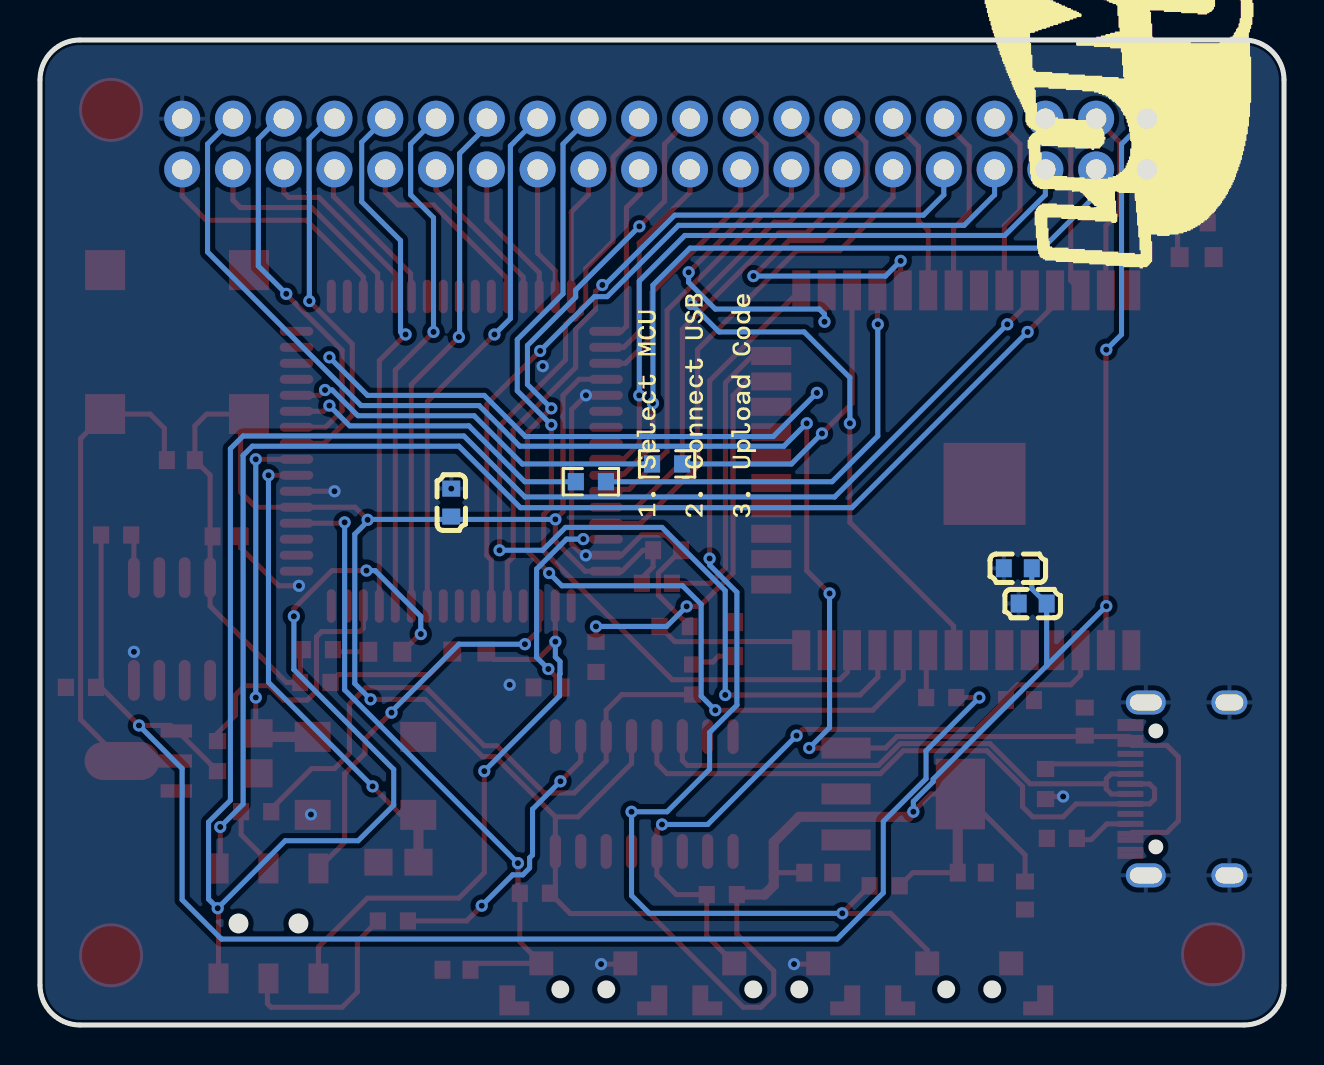
[diagram p2: board, bottom side, seen from below]

Outline 62.23 x 49.28 mm; copper layers: Top Layer, Bottom Layer. Coordinates in mm from the lower left corner of the outline.
Outline path: 0,47.28 0,2 arc(0.59,0.59) 2,0 60.23,0 arc(61.64,0.59) 62.23,2 62.23,47.28 arc(61.64,48.69) 60.23,49.28 2,49.28 arc(0.59,48.69) 0,47.28
Stack: Top Layer 0.035mm / Dielectric1 1.51mm FR4 er 4.5 / Bottom Layer 0.035mm

## Design rules (mm)
template: Custom Config
spacing copperThickness1oz (default): track to track 0.102, other pairs 0.1 to 0.3
spacing copperThickness2oz: track to track 0.203, other pairs 0.152 to 0.3
track width copperThickness1oz (default): min 0.127, default 0.254, max 2.54
track width copperThickness2oz: min 0.203, default 0.254, max 2.54
differential pair differentialPair (default): width min 0.127, default 0.254, max 2.54; gap min 0.152, default 0.152
via viaSize (default): diameter min 0.5, default 0.61, max 10; hole min 0.3, default 0.305, max 6.3

## Placement (name value [footprint] x y rotation side)
AVR  MS-22C01-G010  [SW-SMD_6P-L7.2-W3.5-P2.50-LS6.0-TL]  50.8 5.08 180 top
AVRRESET  TC-S3601-3.5-260G-F0.6  [SW-SMD_TC-S3601-3.5-260G-F0.6]  35.05 2.16 180 top
BOOT  TC-S3601-3.5-260G-F0.6  [SW-SMD_TC-S3601-3.5-260G-F0.6]  15.75 2.16 180 top
BUZZER1  2.7kHz  [BUZ-SMD_4P-L8.5-W8.5-BR-1]  55.37 34.16 90 top
C1  100nF  [C0603]  12.57 21.08 180 bottom
C2  10uF  [C0603]  13.32 22.85 0 bottom
C3  100nF  [C0603]  15.62 7.62 0 top
C4  22pF  [C0805]  51.27 13.59 90 top
C5  22pF  [C0805]  44.3 8.15 180 top
C6  100nF  [C0603]  41.66 26.13 270 bottom
C7  100nF  [C0603]  36.84 16.88 180 top
C8  100nF  [C0603]  55.18 28.26 0 top
C9  10uF  [C0603]  9.97 15.18 270 top
C10  10uF  [C0603]  23.3 7.62 180 top
C11  100nF  [C0603]  30.86 23.75 0 top
C12  100nF  [C0603]  52.9 24.45 0 top
C13  100nF  [C0603]  12.95 6.48 90 top
C14  100nF  [C0603]  13.21 16.26 180 top
C15  100nF  [C0603]  41.4 2.77 180 top
ESPRESET  TC-S3601-3.5-260G-F0.6  [SW-SMD_TC-S3601-3.5-260G-F0.6]  25.4 2.16 180 top
LED2  YLED0603R  [LED0603-FD]  40.75 18.68 180 top
LED3  YLED0603B  [LED0603-FD]  44.96 18.67 180 top
NOREF  -  [Pad_e2586]  58.67 3.49 180 top
NOREF#2  -  [Pad_e2583]  58.67 45.78 180 top
NOREF#3  -  [Pad_e2562]  3.55 3.54 0 top
NOREF#4  -  [Pad_e2559]  3.44 45.74 180 top
Q1  2N2222AU  [SOT-89-3_L4.5-W2.4-P1.50-LS4.0-BR]  56.77 13.21 180 top
R1  10kΩ  [R0603_NEW]  28.12 6.52 0 top
R2  10kΩ  [R0603_NEW]  19.98 6.96 0 top
R3  5.1kΩ  [R0603_NEW]  11.93 12.06 90 top
R4  5.1kΩ  [R0603_NEW]  11.11 9.34 0 top
R7  10kΩ  [R0603_NEW]  37.47 6.59 180 top
R11  330Ω  [R0603_NEW]  48.33 18.78 0 top
R12  330Ω  [R0603_NEW]  48.45 17.14 0 top
R13  330Ω  [R0603_NEW]  4.57 40.13 0 top
R14  330Ω  [R0603_NEW]  29.58 17.28 90 top
R15  1kΩ  [R0603_NEW]  58.42 24.51 0 top
R16  10kΩ  [R0603_NEW]  60.18 16.89 180 top
R17  1kΩ  [R0603_NEW]  17.14 16.38 0 top
R18  1kΩ  [R0603_NEW]  53.35 13.45 90 top
R19  10kΩ  [R0603_NEW]  31.37 22.1 180 top
R20  10kΩ  [R0603_NEW]  34.42 18.41 90 top
R21  100Ω  [R0603_NEW]  44.58 5.21 0 top
R22  100Ω  [R0603_NEW]  51.42 10.67 180 top
R23  100Ω  [R0603_NEW]  34.67 27.18 0 bottom
R24  100Ω  [R0603_NEW]  30.86 28.07 180 bottom
R25  10kΩ  [R0603_NEW]  30.48 19.94 180 top
U1  2.4GHz  [WIFIM-SMD_ESP32-WROOM-32-N4]  16.64 27.75 90 top
U2  ATMEGA128A-AU  [LQFP-64_L14.0-W14.0-P0.80-LS16.0-BL]  41.66 28.7 0 top
U3  CH340C  [SOP-16_L10.0-W3.9-P1.27-LS6.0-BL]  32 11.56 180 top
U4  AMS1117-3.3  [SOT-223_L6.5-W3.5-P2.30-LS7.0-BR]  19.05 11.56 0 top
U5  YLED0603G  [LED0603-FD]  4.37 38.41 180 top
U6  YLED0603G  [LED0603-FD]  27.56 19.3 90 top
U7  P125-1220A0BS116A1  [HDR-TH_40P-P2.54-V-M-R2-C20-S2.54_10-97-7406]  30.99 44.07 0 top
U8  ATTINY13A-SSU  [SOIC-8_L4.9-W3.9-P1.27-LS6.0-BL]  55.63 19.81 0 top
USB1  USB-TYPE-C-018  [USB-C_SMD-TYPE-C-31-M-12]  5.21 11.81 270 top
X1  16MHz  [OSC-SMD_4P-L7.0-W5.0-BL]  45.95 12.46 180 top

## Footprints (pads in the part's own frame, mm; a bottom-side part is the same pattern mirrored in y, then rotated)
BUZ-SMD_4P-L8.5-W8.5-BR-1
  rect 2x2 smd: 1(3.6,-3.6) 2(-3.6,-3.6) 3(-3.6,3.6) 4(3.599,3.599)
C0603
  rect 0.8x0.9 smd: 1(-0.7,0) 2(0.7,0)
C0805
  rect 1.41x1.35 smd: 1(-1,0) 2(1,0)
HDR-TH_40P-P2.54-V-M-R2-C20-S2.54_10-97-7406
  rect 1.575x1.8 hole 1.02: 1(-24.13,-1.27)
  round 1.8 hole 1.02: 2(-24.13,1.27) 3(-21.59,-1.27) 4(-21.59,1.27) 5(-19.05,-1.27) 6(-19.05,1.27) 7(-16.51,-1.27) 8(-16.51,1.27) 9(-13.97,-1.27) 10(-13.97,1.27) 11(-11.43,-1.27) 12(-11.43,1.27) 13(-8.89,-1.27) 14(-8.89,1.27) 15(-6.35,-1.27) 16(-6.35,1.27) 17(-3.81,-1.27) 18(-3.81,1.27) 19(-1.27,-1.27) 20(-1.27,1.27) 21(1.27,-1.27) 22(1.27,1.27) 23(3.81,-1.27) 24(3.81,1.27) 25(6.35,-1.27) 26(6.35,1.27) 27(8.89,-1.27) 28(8.89,1.27) 29(11.43,-1.27) 30(11.43,1.27) 31(13.97,-1.27) 32(13.97,1.27) 33(16.51,-1.27) 34(16.51,1.27) 35(19.05,-1.27) 36(19.05,1.27) 37(21.59,-1.27) 38(21.59,1.27) 39(24.13,-1.27) 40(24.13,1.27)
LED0603-FD
  rect 0.9x1 smd: 1(-0.85,0) 2(0.85,0)
LQFP-64_L14.0-W14.0-P0.80-LS16.0-BL
  oval 0.448x1.684 smd: 1(-6,-7.742) 2(-5.2,-7.742) 3(-4.4,-7.742) 4(-3.6,-7.742) 5(-2.8,-7.742) 6(-2,-7.742) 7(-1.2,-7.742) 8(-0.4,-7.742) 9(0.4,-7.742) 10(1.2,-7.742) 11(2,-7.742) 12(2.8,-7.742) 13(3.6,-7.742) 14(4.4,-7.742) 15(5.2,-7.742) 16(6,-7.742) 33(6,7.742) 34(5.2,7.742) 35(4.4,7.742) 36(3.6,7.742) 37(2.8,7.742) 38(2,7.742) 39(1.2,7.742) 40(0.4,7.742) 41(-0.4,7.742) 42(-1.2,7.742) 43(-2,7.742) 44(-2.8,7.742) 45(-3.6,7.742) 46(-4.4,7.742) 47(-5.2,7.742) 48(-6,7.742)
  oval 1.684x0.448 smd: 17(7.742,-6) 18(7.742,-5.2) 19(7.742,-4.4) 20(7.742,-3.6) 21(7.742,-2.8) 22(7.742,-2) 23(7.742,-1.2) 24(7.742,-0.4) 25(7.742,0.4) 26(7.742,1.2) 27(7.742,2) 28(7.742,2.8) 29(7.742,3.6) 30(7.742,4.4) 31(7.742,5.2) 32(7.742,6) 49(-7.742,6) 50(-7.742,5.2) 51(-7.742,4.4) 52(-7.742,3.6) 53(-7.742,2.8) 54(-7.742,2) 55(-7.742,1.2) 56(-7.742,0.4) 57(-7.742,-0.4) 58(-7.742,-1.2) 59(-7.742,-2) 60(-7.742,-2.8) 61(-7.742,-3.6) 62(-7.742,-4.4) 63(-7.742,-5.2) 64(-7.742,-6)
OSC-SMD_4P-L7.0-W5.0-BL
  rect 1.8x1.5 smd: 1(-2.64,-1.95) 2(2.64,-1.95) 3(2.64,1.95) 4(-2.64,1.95)
Pad_e2559
  round 3.2 smd: 1(0,0)
Pad_e2562
  round 3.2 smd: 1(0,0)
Pad_e2583
  round 3.2 smd: 1(0,0)
Pad_e2586
  round 3.2 smd: 1(0,0)
R0603_NEW
  rect 0.806x0.864 smd: 1(-0.753,0) 2(0.753,0)
SOIC-8_L4.9-W3.9-P1.27-LS6.0-BL
  oval 0.588x2.045 smd: 1(-1.905,-2.57) 2(-0.635,-2.57) 3(0.635,-2.57) 4(1.905,-2.57) 5(1.905,2.57) 6(0.635,2.57) 7(-0.635,2.57) 8(-1.905,2.57)
SOP-16_L10.0-W3.9-P1.27-LS6.0-BL
  oval 0.56x1.745 smd: 1(-4.445,-2.873) 2(-3.175,-2.873) 3(-1.905,-2.873) 4(-0.635,-2.873) 5(0.635,-2.873) 6(1.905,-2.873) 7(3.175,-2.873) 8(4.445,-2.873) 9(4.445,2.873) 10(3.175,2.873) 11(1.905,2.873) 12(0.635,2.873) 13(-0.635,2.873) 14(-1.905,2.873) 15(-3.175,2.873) 16(-4.445,2.873)
SOT-89-3_L4.5-W2.4-P1.50-LS4.0-BR
  rect 1.575x0.672 smd: 1(1.357,-1.5) 3(1.357,1.5)
  custom 5.377x1.9 smd: 2(-1.357,-0.001)
SOT-223_L6.5-W3.5-P2.30-LS7.0-BR
  rect 2.465x1.05 smd: 1(2.857,-2.3) 2(2.857,0) 3(2.857,2.3)
  rect 2.465x3.54 smd: 4(-2.857,0)
SW-SMD_6P-L7.2-W3.5-P2.50-LS6.0-TL
  rect 1x1.5 smd: 1(-2.5,2.75) 2(0,2.75) 3(2.5,2.75) 4(-2.5,-2.75) 5(0,-2.75) 6(2.5,-2.75)
SW-SMD_TC-S3601-3.5-260G-F0.6
  rect 1.2x1.2 smd: 1(-2.1,-0.925) 2(2.1,-0.925)
  custom 1.5x1.5 smd: 3(3.45,0.925) 4(-3.45,0.925)
USB-C_SMD-TYPE-C-31-M-12
  oval 1.2x2 hole 0.8x1.6: 0(-4.325,1.706) 1(4.325,1.706)
  oval 1.2x1.8 hole 0.8x1.4: 2(4.325,-2.474) 3(-4.325,-2.474)
  rect 0.3x1.3 smd: A1(-3.35,2.474) A4(-2.55,2.474) A5(-1.25,2.474) A6(-0.25,2.474) A7(0.25,2.474) A8(1.25,2.474) A9(2.55,2.474) A12(3.35,2.474) B1(3.05,2.474) B4(2.25,2.474) B5(1.75,2.474) B6(0.75,2.474) B7(-0.75,2.474) B8(-1.75,2.474) B9(-2.25,2.474) B12(-3.05,2.474)
WIFIM-SMD_ESP32-WROOM-32-N4
  rect 2x0.9 smd: 1(-9,9.005) 2(-9,7.735) 3(-9,6.465) 4(-9,5.195) 5(-9,3.925) 6(-9,2.655) 7(-9,1.385) 8(-9,0.115) 9(-9,-1.155) 10(-9,-2.425) 11(-9,-3.695) 12(-9,-4.965) 13(-9,-6.235) 14(-9,-7.505) 25(9,-7.505) 26(9,-6.235) 27(9,-4.965) 28(9,-3.695) 29(9,-2.425) 30(9,-1.155) 31(9,0.115) 32(9,1.385) 33(9,2.655) 34(9,3.925) 35(9,5.195) 36(9,6.465) 37(9,7.735) 38(9,9.005)
  rect 0.9x2 smd: 15(-5.715,-9.005) 16(-4.445,-9.005) 17(-3.175,-9.005) 18(-1.905,-9.005) 19(-0.635,-9.005) 20(0.635,-9.005) 21(1.905,-9.005) 22(3.175,-9.005) 23(4.445,-9.005) 24(5.715,-9.005)
  rect 4.1x4.1 smd: 39(-0.68,1.665)

## Nets
As in the schematic, except:
GND: AVRRESET.2 BOOT.2 C1.1 C2.2 C3.1 C4.1 C5.1 C6.1 C7.1 C9.1 C10.2 C11.1 C12.1 C13.1 C14.2 C15.1 ESPRESET.2 NOREF.1 NOREF#2.1 NOREF#3.1 NOREF#4.1 Q1.3 R3.1 R4.2 R16.1 R20.1 R25.2 U1.1 U1.15 U1.38 U1.39 U2.22 U2.53 U2.63 U3.1 U4.1 U5.2 U6.2 U7.1 U7.40 U8.4 USB1.0 USB1.1 USB1.2 USB1.3 USB1.A1 USB1.A12 USB1.B1 USB1.B12 X1.4
$1N20330: R24.2 U1.27
$1N20335: R24.1 U2.28

Pads without a net: AVRRESET 3 4; BOOT 3 4; BUZZER1 1 4; ESPRESET 3 4; U1 4 5 6 7 13 16 17 18 19 20 21 22 32; U2 1 4 7 8 9 15 16 17 18 19 29 30 31 32 33 34 39 40 41 42 43 54 55 56; U3 7 8 9 10 11 14 15; U4 2; U8 1 2 3 6 7; USB1 A8 B8; X1 2

## Via types
v1: diameter 0.61, hole 0.305, Top Layer to Bottom Layer, 80 vias

## Routing (per net, layer and track width the routed paths; a pad name or vN(x,y) marks a point on that pad's centre or on a via; arc(x,y) is an arc through that point)
+5V: length 84.3
  Top Layer w0.254: USB1.A9 USB1.B4 7.61,9.63 5.86,9.63 5.28,10.21 5.28,13.41 5.86,13.99 7.61,13.99 USB1.B9 USB1.A4 7.75,14.43 19.36,14.43 19.93,13.86 U4.3 v1(23.75,13.86) ; v1(22.73,21.59) 23.88,22.73 v1(23.88,30.1)
  Bottom Layer w0.254: v1(22.73,21.59) 22.73,14.87 v1(23.75,13.86) ; U7.38 53.85,44.07 53.85,38.67 46.17,30.99 40.26,30.99 38.23,28.96 25.02,28.96 v1(23.88,30.1)
GND: length 29.7
  Top Layer w0.254: v1(24.51,3.05) 23.34,3.05 ESPRESET.2 ; R25.2 31.3,21.51 31.3,22.61 C11.1 30.92,24.51 32.13,24.51 33.14,23.5 U2.63 34.92,23.5 v1(34.92,23.49) 35.06,23.49 35.64,24.07 35.64,30.78 v1(34.92,31.5) U2.53 ; 32.95,3.08 32.99,3.05 v1(34.16,3.05) ; U2.22 v1(47.5,26.7) ; v1(49.28,21.97) 50.29,21.97 52.2,23.88 C12.1 ; v1(11.05,11.43) 11.8,11.43 R3.1
  vias: v1(37.08,32.96) v1(38.73,17.02) v1(41.66,26.83) v1(48.68,10.53) v1(57.53,18.67)
VCC: length 191.3
  Top Layer w0.254: C3.2 18.57,7.62 R2.1 ; 16.32,11.56 17.65,11.56 v1(18.54,10.67) ; v1(45.69,16.29) 42.96,16.29 40.1,13.43 39.46,13.43 36.45,10.41 ; R11.2 49.21,18.65 R12.2 49.9,17.14 53.72,20.95 U8.8 53.72,27.5 C8.1 54.48,29.97 53.89,30.56 BUZZER1.3 52.2,30.14 52.2,26.67 51.43,25.91 49.4,25.91 U2.21 46.47,25.9 v1(45.84,25.27) ; 36.45,10.41 U3.16 36.45,6.86 R7.2 35.7,5.58 31.74,5.58 27.05,0.89 26.16,0.89 25.53,1.52 25.53,2.71 27.37,4.55 R1.1 ; 36.45,10.41 35.31,10.41 32.64,13.08 U3.4 ; R19.1 32.12,22.36 31.56,22.92 C11.2 32.07,23.75 33.12,22.7 U2.64 34.96,22.7 36.45,24.19 v1(36.45,25.29) 36.07,25.68 36.07,31.5 35.26,32.3 U2.52 ; U1.2 8.91,33.76 v1(8.89,33.78) ; 25.53,7.45 25.35,7.62 24,7.62 ; C13.2 12.95,8.51 16,11.56 ; U7.2 5.71,44.2 5.71,42.03 R13.1
  Top Layer w0.508: R1.1 25.99,6.52 25.53,6.98 25.53,9.14 24.26,10.41 18.8,10.41 v1(18.54,10.67) ; C3.2 16.32,11.35
  Bottom Layer w0.254: U7.2 8.13,44.07 8.13,34.54 v1(8.89,33.78) ; C2.1 12.62,21.82 C1.2 ; v1(36.45,25.29) 45.74,25.29 46.48,24.55 46.48,17.08 v1(45.69,16.29) ; 11.75,20.95 C1.2 ; C1.2 11.87,17.97 ; 11.87,17.97 17.55,12.29 17.55,12.17 18.54,11.18 v1(18.54,10.67) ; 11.87,17.97 v1(8.89,20.95)
(no net): length 27.4
  Bottom Layer w0.254: v1(47.75,33.4) 45.85,31.5 40,31.5 37.95,29.44 25.55,29.44 v1(23.37,31.62) ; 47.75,45.34 47.5,45.34 ; 50.29,45.34 50.04,45.34
1: length 9.4
  Top Layer w0.254: U1.37 8.91,39.99 8.22,40.68 8.22,44.16 U7.4
2: length 9.3
  Top Layer w0.254: U1.36 10.67,37.24 10.67,44.07 11.94,45.34
3: length 9.4
  Top Layer w0.254: U7.8 13.21,44.07 13.21,40.77 13.99,39.99 U1.33
4: length 9.4
  Top Layer w0.254: U7.10 17.02,45.21 15.75,43.94 15.75,40.64 16.53,39.86 U1.31
5: length 9.3
  Top Layer w0.254: 19.56,45.34 19.56,45.21 18.29,43.94 18.29,40.24 17.8,39.75 U1.30
6: length 20.9
  Top Layer w0.254: v1(26.54,37.46) 24.77,39.24 23.11,39.24 20.92,41.44 20.92,44.16 U7.14 ; v1(19.18,38.23) 19.18,36.86 U1.29
  Bottom Layer w0.254: v1(19.18,38.23) 19.94,37.46 v1(26.54,37.46)
7: length 41.2
  Top Layer w0.254: v1(37.21,33.72) 39.88,31.05 39.88,23.49 39.66,23.27 U2.6
  Bottom Layer w0.254: U7.7 14.48,41.53 16,40 30.29,40 33.86,36.44 34.5,36.44 v1(37.21,33.72)
7#: length 38.1
  Top Layer w0.254: v1(29.65,36.07) 29.59,36.07 25.5,40.16 24.74,40.16 23.37,41.53 23.37,44.07 U7.16 ; U1.8 16.53,19.96 21.72,25.15 v1(21.72,30.1)
  Bottom Layer w0.254: v1(21.72,30.1) 21.72,32.38 24,34.67 28.26,34.67 v1(29.65,36.07)
8: length 19.8
  Top Layer w0.254: U7.18 25.91,44.07 25.91,41.53 v1(29.78,37.66) ; v1(22.99,35.18) 22.99,36.64 U1.26
  Bottom Layer w0.254: v1(22.99,35.18) 22.99,35.56 23.24,35.81 28.45,35.81 29.78,37.15 v1(29.78,37.66)
9: length 38.2
  Top Layer w0.254: v1(34.1,37.02) 34.44,36.68 34.44,35.79 35.43,34.8 35.43,32.89 38.56,29.77 38.56,23.42 38.86,23.12 U2.5
  Bottom Layer w0.254: U7.9 17.02,41.53 18.03,40.51 30.48,40.51 33.97,37.02 v1(34.1,37.02)
9#: length 52.9
  Top Layer w0.254: v1(28.45,15.75) 20.57,15.75 19.05,17.27 19.05,18.73 U1.10 ; v1(36.76,22.61) 37.85,23.69 37.85,29.65 v1(36.65,30.85) ; v1(32.25,39.95) 30.99,41.21 30.99,44.07 29.72,45.34
  Bottom Layer w0.254: v1(28.45,15.75) 29.16,16.46 29.16,21.04 30.09,21.97 36.12,21.97 v1(36.76,22.61) ; v1(36.65,30.85) 37.85,32.04 37.85,33.99 35.43,36.41 35.43,36.77 v1(32.25,39.95)
10: length 52.3
  Top Layer w0.254: v1(39.24,23.75) 39.24,29.97 35.94,33.27 35.94,35.05 35.67,35.32 35.45,35.32 35.15,35.62 35.15,35.84 34.92,36.07 34.92,37.85 33.56,39.21 33.56,43.41 32.39,44.59 32.39,45.21 U7.22 ; U1.11 20.32,18.73 20.32,17.4 21.21,16.51 v1(27.95,16.51)
  Bottom Layer w0.254: v1(27.95,16.51) 27.95,21.73 31.11,24.89 35.94,24.89 37.08,23.75 v1(39.24,23.75)
11: length 43.2
  Top Layer w0.254: v1(36.65,30.02) 36.65,25.92 37.03,25.54 37.03,23.71 30.6,17.27 22.23,17.27 21.84,17.65 21.84,18.52 U1.12
  Bottom Layer w0.254: v1(36.65,30.02) 38.35,31.73 38.35,34.29 36.07,36.58 36.07,44.07 U7.24
AT_RX: length 30.4
  Top Layer w0.254: LED2.2 39.51,18.29 37.34,18.29 v1(36.45,19.18) 36.45,19.81 36.46,19.82 U2.2 ; AVR.3 48.3,3.9 45.85,6.35 41.27,6.35 40,7.62 v1(40,12.7)
  Bottom Layer w0.254: v1(40,12.7) 36.24,16.47 36.24,17.55 36.22,17.57 36.22,18.18 36.45,18.41 v1(36.45,19.18)
AT_TX: length 19.6
  Top Layer w0.254: U2.3 37.26,19.77 v1(37.97,19.05) ; v1(44.65,15.63) 45.97,14.3 45.97,13.59 46.99,12.57 46.99,9.14 AVR.6
  Bottom Layer w0.254: v1(37.97,19.05) 41.27,19.05 44.65,15.68 v1(44.65,15.63)
BUZ: length 74.6
  Top Layer w0.254: R18.1 55.36,14.71 Q1.1 55.69,14.99 v1(57.28,14.99) 59.17,16.88 R15.2 ; R17.1 v1(15.24,16.38)
  Bottom Layer w0.254: v1(15.24,16.38) 17.91,13.72 17.91,12.32 20.04,10.18 20.04,6.61 22.36,4.3 53.15,4.3 55.12,6.27 55.12,12.83 v1(57.28,14.99)
CH_RX: length 31.1
  Top Layer w0.254: 50.66,10.67 50.8,10.67 48.64,12.83 47.5,12.83 46.75,13.57 46.75,16.06 45.93,16.88 42.91,16.88 40,13.97 39.37,13.97 37.01,11.61 35.51,11.61 33.91,13.21 U3.3 33.91,15.75 33.13,16.53 R14.1
CH_TX: length 14.8
  Top Layer w0.254: v1(36.2,12.19) 35.18,13.21 U3.2 ; R21.1 40.89,5.21 v1(40.13,5.97)
  Bottom Layer w0.254: v1(36.2,12.19) 37.59,10.79 37.59,8.51 37.74,8.36 37.74,7.85 38.08,7.51 38.59,7.51 v1(40.13,5.97)
D+: length 31.1
  Top Layer w0.254: U3.5 31.37,13.08 30.86,12.57 20.19,12.57 19.05,13.72 14.86,13.72 13.08,11.94 13.08,10.92 12.57,10.41 11.05,10.41 10.4,11.06 USB1.B6 6.72,11.06 6.48,11.3 6.48,11.81 6.73,12.06 USB1.A6
D-: length 26.9
  Top Layer w0.254: USB1.A7 7.69,11.56 8.64,11.56 8.89,11.81 8.89,12.08 ; 8.89,12.08 8.89,12.32 8.65,12.56 USB1.B7 ; 8.89,12.08 8.91,12.06 12.7,12.06 14.71,14.08 19.2,14.08 20.29,12.98 29.84,12.98 30.1,13.24 U3.6
DT: length 56.5
  Top Layer w0.254: R2.2 22.1,5.6 v1(22.1,5.59) 19.68,5.59 17.85,3.75 BOOT.1 ; U3.13 v1(32.64,10.67) ; U1.25 24.21,36.75 28.73,32.23 v1(28.73,23.34)
  Bottom Layer w0.254: v1(28.73,23.34) 28.73,23.01 27.37,21.65 27.37,16 28.73,14.64 28.73,12.8 30.86,10.67 v1(32.64,10.67) 32.64,6.48 31.75,5.59 v1(22.1,5.59)
ESP_RX: length 106.4
  Top Layer w0.254: LED3.2 43.22,19.56 v1(43.18,19.56) ; v1(53.34,5.84) 53.3,5.8 AVR.1 ; v1(49.53,20.45) 49.53,20.83 47.62,22.73 v1(45.9,22.73) ; U1.34 12.72,36.18 v1(13.84,35.05)
  Bottom Layer w0.254: v1(43.18,19.56) 43.18,20.45 45.47,22.73 v1(45.9,22.73) ; v1(13.84,35.05) 22.48,26.42 37.97,26.42 41.02,29.46 52.07,29.46 52.7,28.83 52.7,11.24 53.8,10.15 53.8,6.3 v1(53.34,5.84) 49.96,9.22 46.31,9.22 44.54,11 44.54,12.79 49.53,17.78 v1(49.53,20.45)
ESP_TX: length 68.2
  Top Layer w0.254: AVR.4 53.21,7.92 v1(53.21,9.91) ; U1.35 11.45,36.05 v1(12.83,34.67)
  Bottom Layer w0.254: v1(12.83,34.67) 21.62,25.88 38.2,25.88 41.27,28.96 51.61,28.96 52.07,28.49 52.07,11.05 v1(53.21,9.91)
MISO: length 26.4
  Top Layer w0.254: v1(43.94,34.54) 45.26,33.23 U2.13
  Bottom Layer w0.254: v1(43.94,34.54) 44.07,34.54 44.2,34.67 44.2,39.24 46.14,41.18 46.14,44.16 U7.32
MOSI: length 26.2
  Top Layer w0.254: v1(42.55,34.67) 44.46,32.76 U2.12
  Bottom Layer w0.254: U7.30 43.69,44.07 43.69,41.53 42.55,40.39 v1(42.55,34.67)
RESET: length 32.2
  Top Layer w0.254: v1(38.32,8.1) 38.32,6.69 R7.1 38.23,4.16 AVRRESET.1 40.38,3.08 C15.2 ; U2.20 47.03,25.1 v1(46.99,25.15)
  Bottom Layer w0.254: v1(46.99,25.15) 46.99,16.76 v1(38.32,8.1)
RT: length 34.9
  Top Layer w0.254: ESPRESET.1 28.88,4.46 R1.2 30.4,6.52 31.37,7.49 U3.12 31.37,9.78 v1(31.11,10.03) ; v1(24.38,14.48) 24.07,14.79 15.38,14.79 C14.1 13.91,16.44 13.33,17.02 10.67,17.02 10.18,17.51 U1.3
  Bottom Layer w0.254: v1(31.11,10.03) 28.83,10.03 v1(24.38,14.48)
SCK: length 25.9
  Top Layer w0.254: U2.11 43.66,32.04 v1(41.27,34.42)
  Bottom Layer w0.254: v1(41.27,34.42) 41.24,34.45 41.24,43.6 39.88,44.96 39.88,45.34
SCL: length 19.5
  Top Layer w0.254: U2.25 48.01,29.1 46.61,30.5 46.61,34.07 48.76,36.22
  Bottom Layer w0.254: 47.75,45.34 48.77,44.32 48.77,41.66 48.76,41.64 v1(48.76,36.22)
SDA: length 19.4
  Top Layer w0.254: U2.26 47.95,29.9 47.12,30.73 47.12,33.75 49.91,36.54 v1(49.91,36.58)
  Bottom Layer w0.254: 50.29,45.34 51.31,44.32 51.31,37.97 v1(49.91,36.58)
SS: length 26.7
  Top Layer w0.254: v1(39.5,34.54) 42.86,31.18 U2.10
  Bottom Layer w0.254: v1(39.5,34.54) 38.7,35.34 38.7,43.98 37.34,45.34
$1N2843: length 4.4
  Top Layer w0.254: 11.93,12.81 11.68,13.06 USB1.A5
$1N2847: length 3.1
  Top Layer w0.254: USB1.B5 8.86,10.06 9.65,9.27 10.41,9.27
$1N4033: length 2.2
  Top Layer w0.254: U6.1 28.28,18.45 28.58,18.16 29.46,18.16 R14.2
$1N4987: length 24.4
  Top Layer w0.254: X1.3 44.17,10.51 v1(45.59,11.94) ; U2.23 v1(50.8,27.5)
  Top Layer w0.508: X1.3 43.3,10.5 C5.2
  Bottom Layer w0.254: v1(50.8,27.5) 50.8,17.14 v1(45.59,11.94)
$1N5002: length 18.6
  Top Layer w0.254: U2.24 v1(51.43,28.3) ; C4.2 51.43,14.76 v1(51.43,16.38)
  Top Layer w0.508: C4.2 51.09,14.41 X1.1
  Bottom Layer w0.254: v1(51.43,28.3) v1(51.43,16.38)
$1N5344: length 10.5
  Top Layer w0.254: v1(35.05,24.31) 35.05,24.3 U2.62 ; v1(36.8,17.81) 36.14,17.15 C7.2
  Bottom Layer w0.254: v1(36.8,17.81) 37.39,18.4 37.39,22.81 35.89,24.31 v1(35.05,24.31)
$1N8862: length 13
  Top Layer w0.254: 46.06,36.44 46.06,37.42 48.89,40.26 53.91,40.26 55.12,41.47 U7.39
$1N8867: length 11.5
  Top Layer w0.254: 45.26,36.44 45.34,36.53 45.34,37.59 48.64,40.89 52.2,40.89 52.58,41.27 U7.37
$1N8877: length 9.5
  Top Layer w0.254: 44.46,36.44 44.46,37.58 48.28,41.4 49.78,41.4 50.04,41.66 U7.35
$1N8884: length 8
  Top Layer w0.254: 47.5,42.8 47.55,42.75 47.55,41.45 43.69,37.59 43.69,36.48 43.66,36.44
$1N9216: length 9.9
  Top Layer w0.254: U7.31 44.96,41.66 44.32,41.02 42.55,41.02 38.86,37.33 38.86,36.44
$1N9221: length 8.2
  Top Layer w0.254: U7.29 42.42,41.78 38.06,37.42 38.06,36.44
$1N9253: length 7.4
  Top Layer w0.254: 39.88,42.8 39.88,40.26 37.26,37.64 37.26,36.44
$1N9297: length 6.7
  Top Layer w0.254: 36.46,36.44 36.46,37.73 37.34,38.61 37.34,42.8
$1N9314: length 6.7
  Top Layer w0.254: U7.23 34.8,41.53 35.66,40.67 35.66,36.44
$1N9319: length 9.3
  Top Layer w0.254: U7.21 32.21,42.75 32.21,41.58 32.89,40.89 32.89,34.96 33.15,34.7 U2.49
$1N9331: length 11.2
  Top Layer w0.254: U2.50 33.03,33.9 32.26,34.67 32.26,39.12 29.72,41.66 29.72,42.8
$1N9344: length 20.9
  Top Layer w0.254: U2.59 33.82,26.8 32.77,26.8 30.86,28.7 30.86,35.75 26.1,40.51 25.53,40.51 24.64,41.4 U7.15
$1N9350: length 23.5
  Top Layer w0.254: U2.60 32.39,25.9 30.1,28.19 30.1,34.8 25.27,39.62 23.88,39.62 22.1,41.4 U7.13
$1N9358: length 25.9
  Top Layer w0.254: 19.56,42.8 19.56,41.4 22.23,38.73 24.38,38.73 29.34,33.78 29.34,27.94 32.17,25.1 U2.61
$1N9422: length 13.1
  Top Layer w0.254: U7.17 27.18,41.09 31.62,36.64 31.62,34.42 32.94,33.1 U2.51
$1N9481: length 36.3
  Top Layer w0.254: v1(31.57,31.1) 31.57,29.01 33.02,27.56 33.86,27.56 U2.58
  Bottom Layer w0.254: U7.3 9.4,41.53 12.06,38.86 29.72,38.86 31.57,37.01 v1(31.57,31.1)
$1N9486: length 33.5
  Top Layer w0.254: v1(32.25,31.5) 32.25,29.09 33.04,28.3 U2.57
  Bottom Layer w0.254: v1(32.25,31.5) 32.25,37.22 29.97,39.5 13.97,39.5 11.94,41.53 11.94,42.8
$1N13451: length 6.7
  Top Layer w0.254: R12.1 47.31,17.53 42.76,17.53 LED2.1
$1N13493: length 1.8
  Top Layer w0.254: U5.1 5.33,38.52 R13.2
$1N13579: length 1.8
  Top Layer w0.254: LED3.1 47.46,18.67 R11.1
$1N15542: length 2.2
  Top Layer w0.254: U8.5 57.53,24.38 R15.1
$1N15554: length 23.6
  Top Layer w0.254: C8.2 56.01,28.39 56.01,29.84 56.73,30.56 BUZZER1.2 60.2,29.34 60.2,15.28 Q1.2
$1N17580: length 2.4
  Top Layer w0.254: U1.9 17.9,18.65 R17.2
$1N17638: length 13.7
  Top Layer w0.254: U2.14 46.06,19.86 46.23,19.68 48.13,19.68 48.4,19.42 48.4,16.72 48.86,16.26 50.04,16.26 50.75,16.97 51.99,16.97 52.45,16.51 52.45,15.49 53.35,14.6 R18.2
$1N19795: length 15.1
  Top Layer w0.254: U1.24 26.61,33.47 27.94,32.13 27.94,22.86 28.7,22.1 R19.2
$1N19800: length 19.8
  Top Layer w0.254: R20.2 v1(34.42,19.94) ; U1.23 26.86,32.2 27.56,31.5 27.56,22.61 29.23,20.94 v1(29.88,20.94)
  Bottom Layer w0.254: v1(29.88,20.94) 30.88,19.94 v1(34.42,19.94)
$1N20128: length 10
  Top Layer w0.254: 50.55,2.08 50.85,1.77 50.85,1.07 50.67,0.89 47.12,0.89 46.36,1.65 46.36,4.18 R21.2
$1N20208: length 3.4
  Top Layer w0.254: AVR.5 50.8,8.15 52.17,9.52 R22.1
$1N20285: length 21.8
  Top Layer w0.254: v1(20.32,35.05) 20.34,35.07 U1.28
  Bottom Layer w0.254: v1(20.32,35.05) 20.32,29.46 22.61,27.18 R23.1
$1N20290: length 15.7
  Top Layer w0.254: U2.27 48.04,30.7 v1(47.75,30.99)
  Bottom Layer w0.254: v1(47.75,30.99) 46.74,29.97 40.77,29.97 37.98,27.18 35.43,27.18
$1N20330: length 15.4
  Top Layer w0.254: U1.27 21.61,31.1 v1(23.11,29.59)
  Bottom Layer w0.254: v1(23.11,29.59) 24.64,28.07 R24.2
$1N20335: length 19.4
  Top Layer w0.254: U2.28 48.24,31.5 v1(47.97,31.77)
  Bottom Layer w0.254: R24.1 38.1,28.07 40.51,30.48 46.33,30.48 47.61,31.77 v1(47.97,31.77)
$1N20374: length 7.6
  Top Layer w0.254: R25.1 30.47,19.18 28.18,19.18 28.17,19.18 24.58,19.18 U1.14

## Copper pours and planes (outline as drawn; the poured copper is in the pictures)
GND on Top Layer: -8.89,36.83 6.6,36.83 6.6,18.41 -8.38,18.41 -8.38,-8.25 69.85,-8.25 69.85,56.77 -8.89,56.77
GND on Bottom Layer: -9.27,54.74 70.36,54.74 70.36,-7.75 -9.27,-7.75

## Text on the board
Top Silkscreen Layer: 3V3 | GND | IO23 | PF3 | IO22 | PF4 | IO21 | PE4 | IO19 | PE3 | IO18 | PF0 | IO5 | PF1 | IO17 | PF2 | IO4 | PA0 | IO25 | PA1 | IO26 | PA2 | IO27 | PA3 | CS | PA4 | SCK | PA5 | MOSI | PA6 | MISO | PA7 | SCL | PC3 | SDA | PC2 | 5V | PC1 | ESP | FLASH
